# Altium schematic sheet Sensors.SchDoc
size Letter
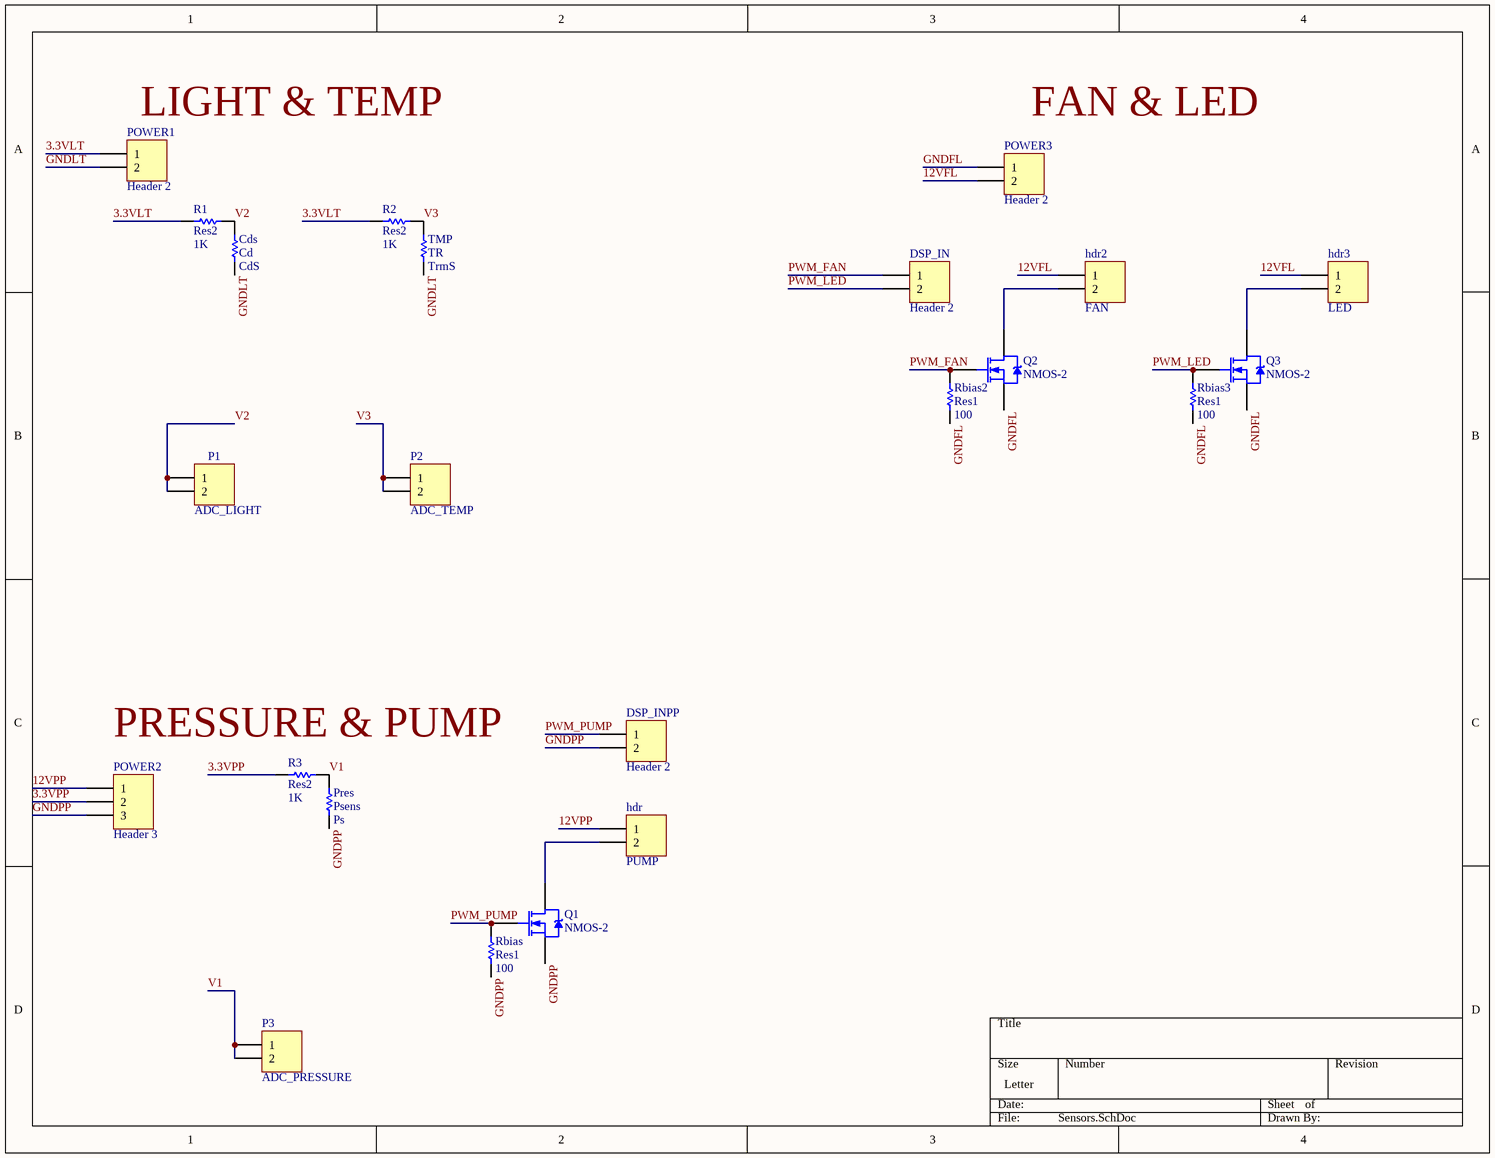
[diagram p0: Sensors.SchDoc]

## Parts
Cds  Cd  value CdS  [AXIAL-0.3]
DSP_IN  Header 2  [HDR1X2]
DSP_INPP  Header 2  [HDR1X2]
hdr  PUMP  [HDR1X2]
hdr2  FAN  [HDR1X2]
hdr3  LED  [HDR1X2]
P1  ADC_LIGHT  [HDR1X2]
P2  ADC_TEMP  [HDR1X2]
P3  ADC_PRESSURE  [HDR1X2]
POWER1  Header 2  [HDR1X2]
POWER2  Header 3  [HDR1X3]
POWER3  Header 2  [HDR1X2]
Pres  Psens  value Ps  [AXIAL-0.3]
Q1  NMOS-2  [TO-220AB]
Q2  NMOS-2  [TO-220AB]
Q3  NMOS-2  [TO-220AB]
R1  Res2  value 1K  [AXIAL-0.3]
R2  Res2  value 1K  [AXIAL-0.3]
R3  Res2  value 1K  [AXIAL-0.3]
Rbias  Res1  value 100  [AXIAL-0.3]
Rbias2  Res1  value 100  [AXIAL-0.3]
Rbias3  Res1  value 100  [AXIAL-0.3]
TMP  TR  value TrmS  [AXIAL-0.3]

## Nets
3.3VLT: POWER1.1 R1.2 R2.2
3.3VPP: POWER2.2 R3.2
12VFL: hdr2.1 hdr3.1 POWER3.2
12VPP: hdr.1 POWER2.1
GNDFL: POWER3.1 Q2.3(S) Q3.3(S) Rbias2.1 Rbias3.1
GNDLT: Cds.1 POWER1.2 TMP.1
GNDPP: DSP_INPP.2 POWER2.3 Pres.1 Q1.3(S) Rbias.1
PWM_FAN: DSP_IN.1 Q2.1(G) Rbias2.2
PWM_LED: DSP_IN.2 Q3.1(G) Rbias3.2
PWM_PUMP: DSP_INPP.1 Q1.1(G) Rbias.2
V1: P3.1 P3.2 Pres.2 R3.1
V2: Cds.2 P1.1 P1.2 R1.1
V3: P2.1 P2.2 R2.1 TMP.2
Nethdr2_2: hdr2.2 Q2.2(D)
Nethdr3_2: hdr3.2 Q3.2(D)
Nethdr_2: hdr.2 Q1.2(D)

## Notes on the sheet
- Labels drawn without touching a wire or pin: FAN & LED, LIGHT & TEMP, PRESSURE & PUMP

## Library data of the parts
Cds Pres R1-R3 Rbias Rbias2 Rbias3 TMP = Res1: Resistor; Published: 8-Jun-2000; LatestRevisionDate: 17-Jul-2002; LatestRevisionNote: Re-released for DXP Platform.; PackageReference: AXIAL-0.3; Publisher: Altium Limited; PackageDescription: Axial Device, Thru-Hole; 2 Leads; 0.3 in Pin Spacing
DSP_IN DSP_INPP hdr hdr2 hdr3 P1-P3 POWER1 POWER3 = Header 2: Header, 2-Pin; LatestRevisionDate: 17-Jul-2002; LatestRevisionNote: Re-released for DXP Platform.; Publisher: Altium Limited
POWER2 = Header 3: Header, 3-Pin; LatestRevisionDate: 17-Jul-2002; LatestRevisionNote: Re-released for DXP Platform.; Publisher: Altium Limited
Q1-Q3 = NMOS-2: N-Channel Power MOSFET; Note: Pin 2 is electrically connected to pin 4.; Published: 8-Jun-2000; LatestRevisionDate: 17-Jul-2002; LatestRevisionNote: Re-released for DXP Platform.; DatasheetVersion: PD-9.814; PackageVersion: Feb-1997; PackageReference: TO-220AB; Publisher: Altium Limited; PackageDescription: TO, Thru-Hole, Vertical, Heatsink Mounted; 3 In-Line Leads; Pitch 2.54 mm; ComponentLink1Description: Manufacturer Link; ComponentLink1URL: http://www.irf.com/